# EAGLE design v3_to_v2 (EAGLE 5.06)
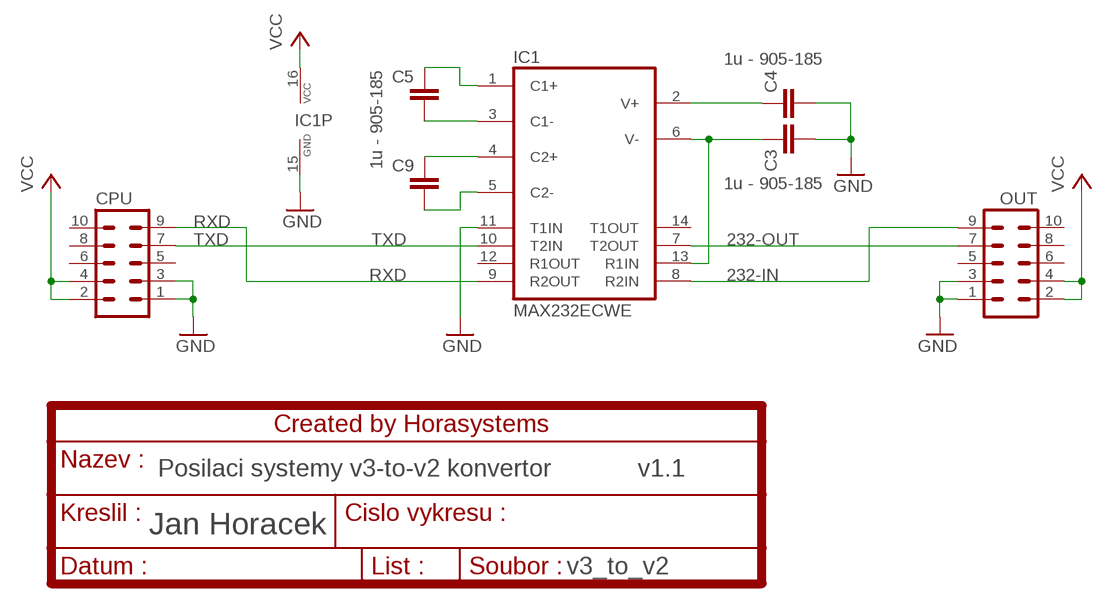
[diagram p0: schematic, sheet 1]

## Parts
C3  1u - 905-185  C-EUC0805  [C0805]
C4  1u - 905-185  C-EUC0805  [C0805]
C5  1u - 905-185  C-EUC0805  [C0805]
C9  1u - 905-185  C-EUC0805  [C0805]
CPU  ML10L  [ML10L]
IC1  MAX232ECWE  [SO16L]
OUT  ML10L  [ML10L]

## Nets
232-IN: IC1.8(R2IN) OUT.9
232-OUT: IC1.7(T2OUT) OUT.7
GND: C3.2 C4.2 CPU.1 CPU.3 IC1.11(T1IN) IC1.15(GND) OUT.1 OUT.3
N$7: C5.1 IC1.1(C1+)
N$8: C5.2 IC1.3(C1-)
N$9: C9.1 IC1.4(C2+)
N$11: C9.2 IC1.5(C2-)
N$12: C3.1 IC1.6(V-) IC1.13(R1IN)
N$13: C4.1 IC1.2(V+)
RXD: CPU.9 IC1.9(R2OUT)
TXD: CPU.7 IC1.10(T2IN)
VCC: CPU.2 CPU.4 IC1.16(VCC) OUT.2 OUT.4
Unconnected: CPU.5 CPU.6 CPU.8 CPU.10 IC1.12(R1OUT) IC1.14(T1OUT) OUT.5 OUT.6 OUT.8 OUT.10

## Notes on the sheet
- Posilaci systemy v3-to-v2 konvertor | v1.1

## Library data of the parts
C3-C5 C9 = rcl:C-EU: CAPACITOR, European symbol
CPU OUT = con-harting-ml:ML10: HARTING
IC1 = maxim:MAX232ECWE: RS232 TRANSEIVER

## Board
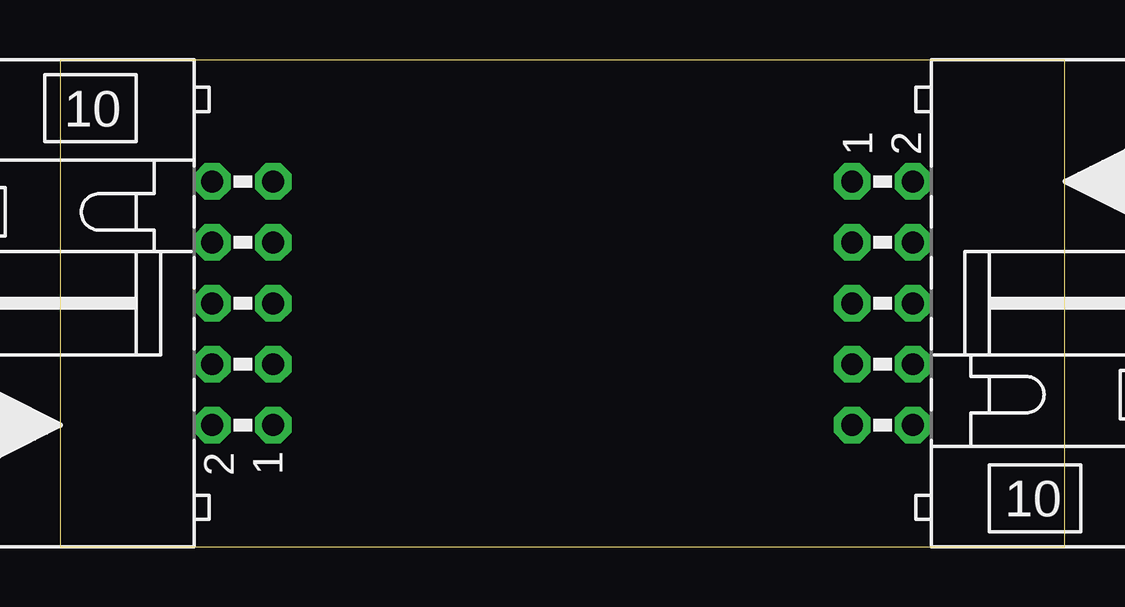
[diagram p1: board, top side]
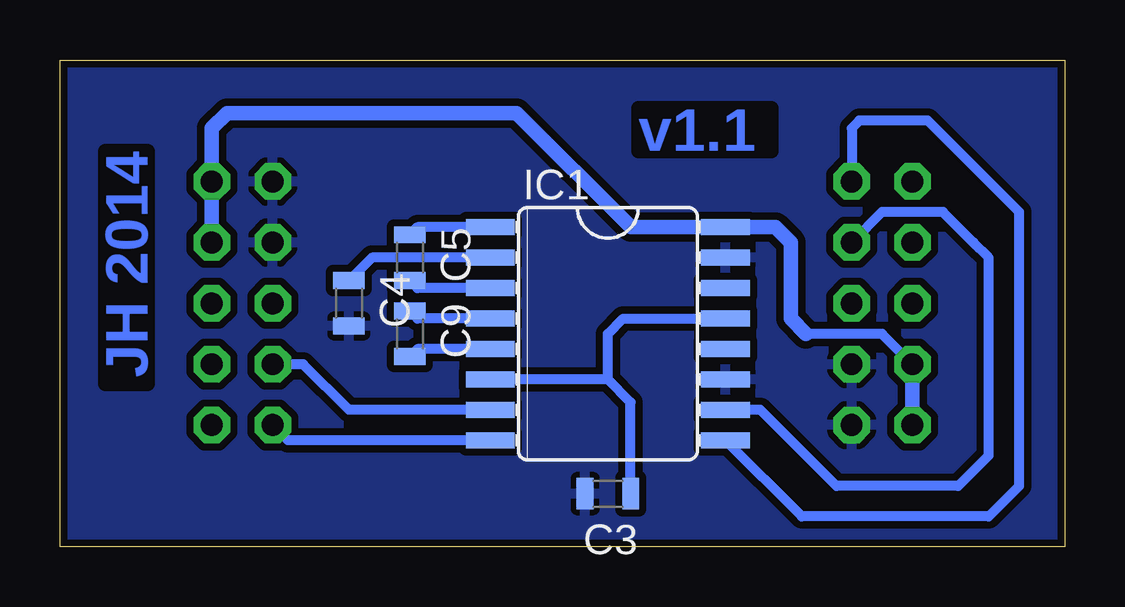
[diagram p2: board, bottom side, seen from below]

Size 41.89 x 20.31 mm. Coordinates in mm from the lower left corner, seen from the top.
Outline: 0,0 41.89,0 41.89,20.31 0,20.31 0,0
Copper layers (1*16): Top 0.036mm / dielectric 1.5011mm / Bottom 0.0356mm
Design rules "EBT_fotocesta_H": minimum track width 0.3mm, minimum drill 0.6mm, track to track 0.3mm, track to pad 0.3mm, pad to pad 0.2mm, via to via 0.2mm, smd to smd 0mil, copper to edge 0.1mm, drill to drill 0.5mm, minimum pad ring 0.3mm, minimum via ring 0.4mm, stop-mask expansion 0mil, vias tented up to drill 0mil, thermal gap 10mil

### Footprints (pad centres in the part's own frame; a part is rotated, then mirrored left to right if it is on the bottom)
C0805 = smd 0.7 x 1.3: 1 -0.95,0; 2 0.95,0
ML10L = drill 0.914 octagon: 1 -5.08,-1.27; 2 -5.08,1.27; 3 -2.54,-1.27; 4 -2.54,1.27; 5 0,-1.27; 6 0,1.27; 7 2.54,-1.27; 8 2.54,1.27; 9 5.08,-1.27; 10 5.08,1.27
SO16L = smd 0.66 x 2.032: 1 -4.445,-4.902; 2 -3.175,-4.902; 3 -1.905,-4.902; 4 -0.635,-4.902; 5 0.635,-4.902; 6 1.905,-4.902; 7 3.175,-4.902; 8 4.445,-4.902; 9 4.445,4.902; 10 3.175,4.902; 11 1.905,4.902; 12 0.635,4.902; 13 -0.635,4.902; 14 -1.905,4.902; 15 -3.175,4.902; 16 -4.445,4.902

### Placement (x,y rotation side)
C3  19.05,2.22 180 bottom
C4  29.84,10.16 270 bottom
C5  27.3,12.06 270 bottom
C9  27.3,8.89 270 bottom
CPU  7.62,10.16 90 top
IC1  19.05,8.89 270 bottom
OUT  34.29,10.16 270 top

### Tracks (layer width: path | path; a pad name or v marks a point on that pad's centre or on a via)
232-IN
  Bottom 0.406: IC1.8 32.38,4.45 OUT.9
232-OUT
  Bottom 0.406: IC1.7 29.84,5.71 31.75,7.62 OUT.7
GND
  pour Bottom (isolate 0.305): 0,0 0,20.32 41.91,20.32 41.91,0
N$7
  Bottom 0.406: IC1.1 26.98,13.34 C5.1
N$8
  Bottom 0.406: IC1.3 26.98,10.79 C5.2
N$9
  Bottom 0.406: IC1.4 26.99,9.53 C9.1
N$11
  Bottom 0.406: IC1.5 26.99,8.26 C9.2
N$12
  Bottom 0.406: IC1.13 18.41,9.53 19.05,8.89 19.05,6.99 | 19.05,6.99 IC1.6 | C3.1 18.1,6.04 19.05,6.99
N$13
  Bottom 0.406: IC1.2 28.89,12.06 C4.1
RXD
  Bottom 0.406: IC1.9 10.97,1.27 3.17,1.27 1.91,2.54 1.91,13.97 5.71,17.78 8.57,17.78 8.89,17.46 CPU.9
TXD
  Bottom 0.406: IC1.10 12.7,5.71 9.53,2.54 4.45,2.54 3.17,3.81 3.17,12.06 3.81,12.7 5.08,13.97 7.62,13.97 CPU.7
VCC
  Bottom 0.406: CPU.4 7.62,8.89 10.79,8.89
  Bottom 0.61: 10.79,8.89 11.43,9.53 11.43,12.7 12.06,13.34 IC1.16 18.1,13.34 22.86,18.1 34.92,18.1 35.56,17.46 OUT.2 OUT.4 | CPU.2 CPU.4

### Text on the board
Bottom: v1.1 | JH 2014